# EAGLE design 230V (EAGLE 5.11)
ABBREV: jn6; PROJECT: JeeNode v6
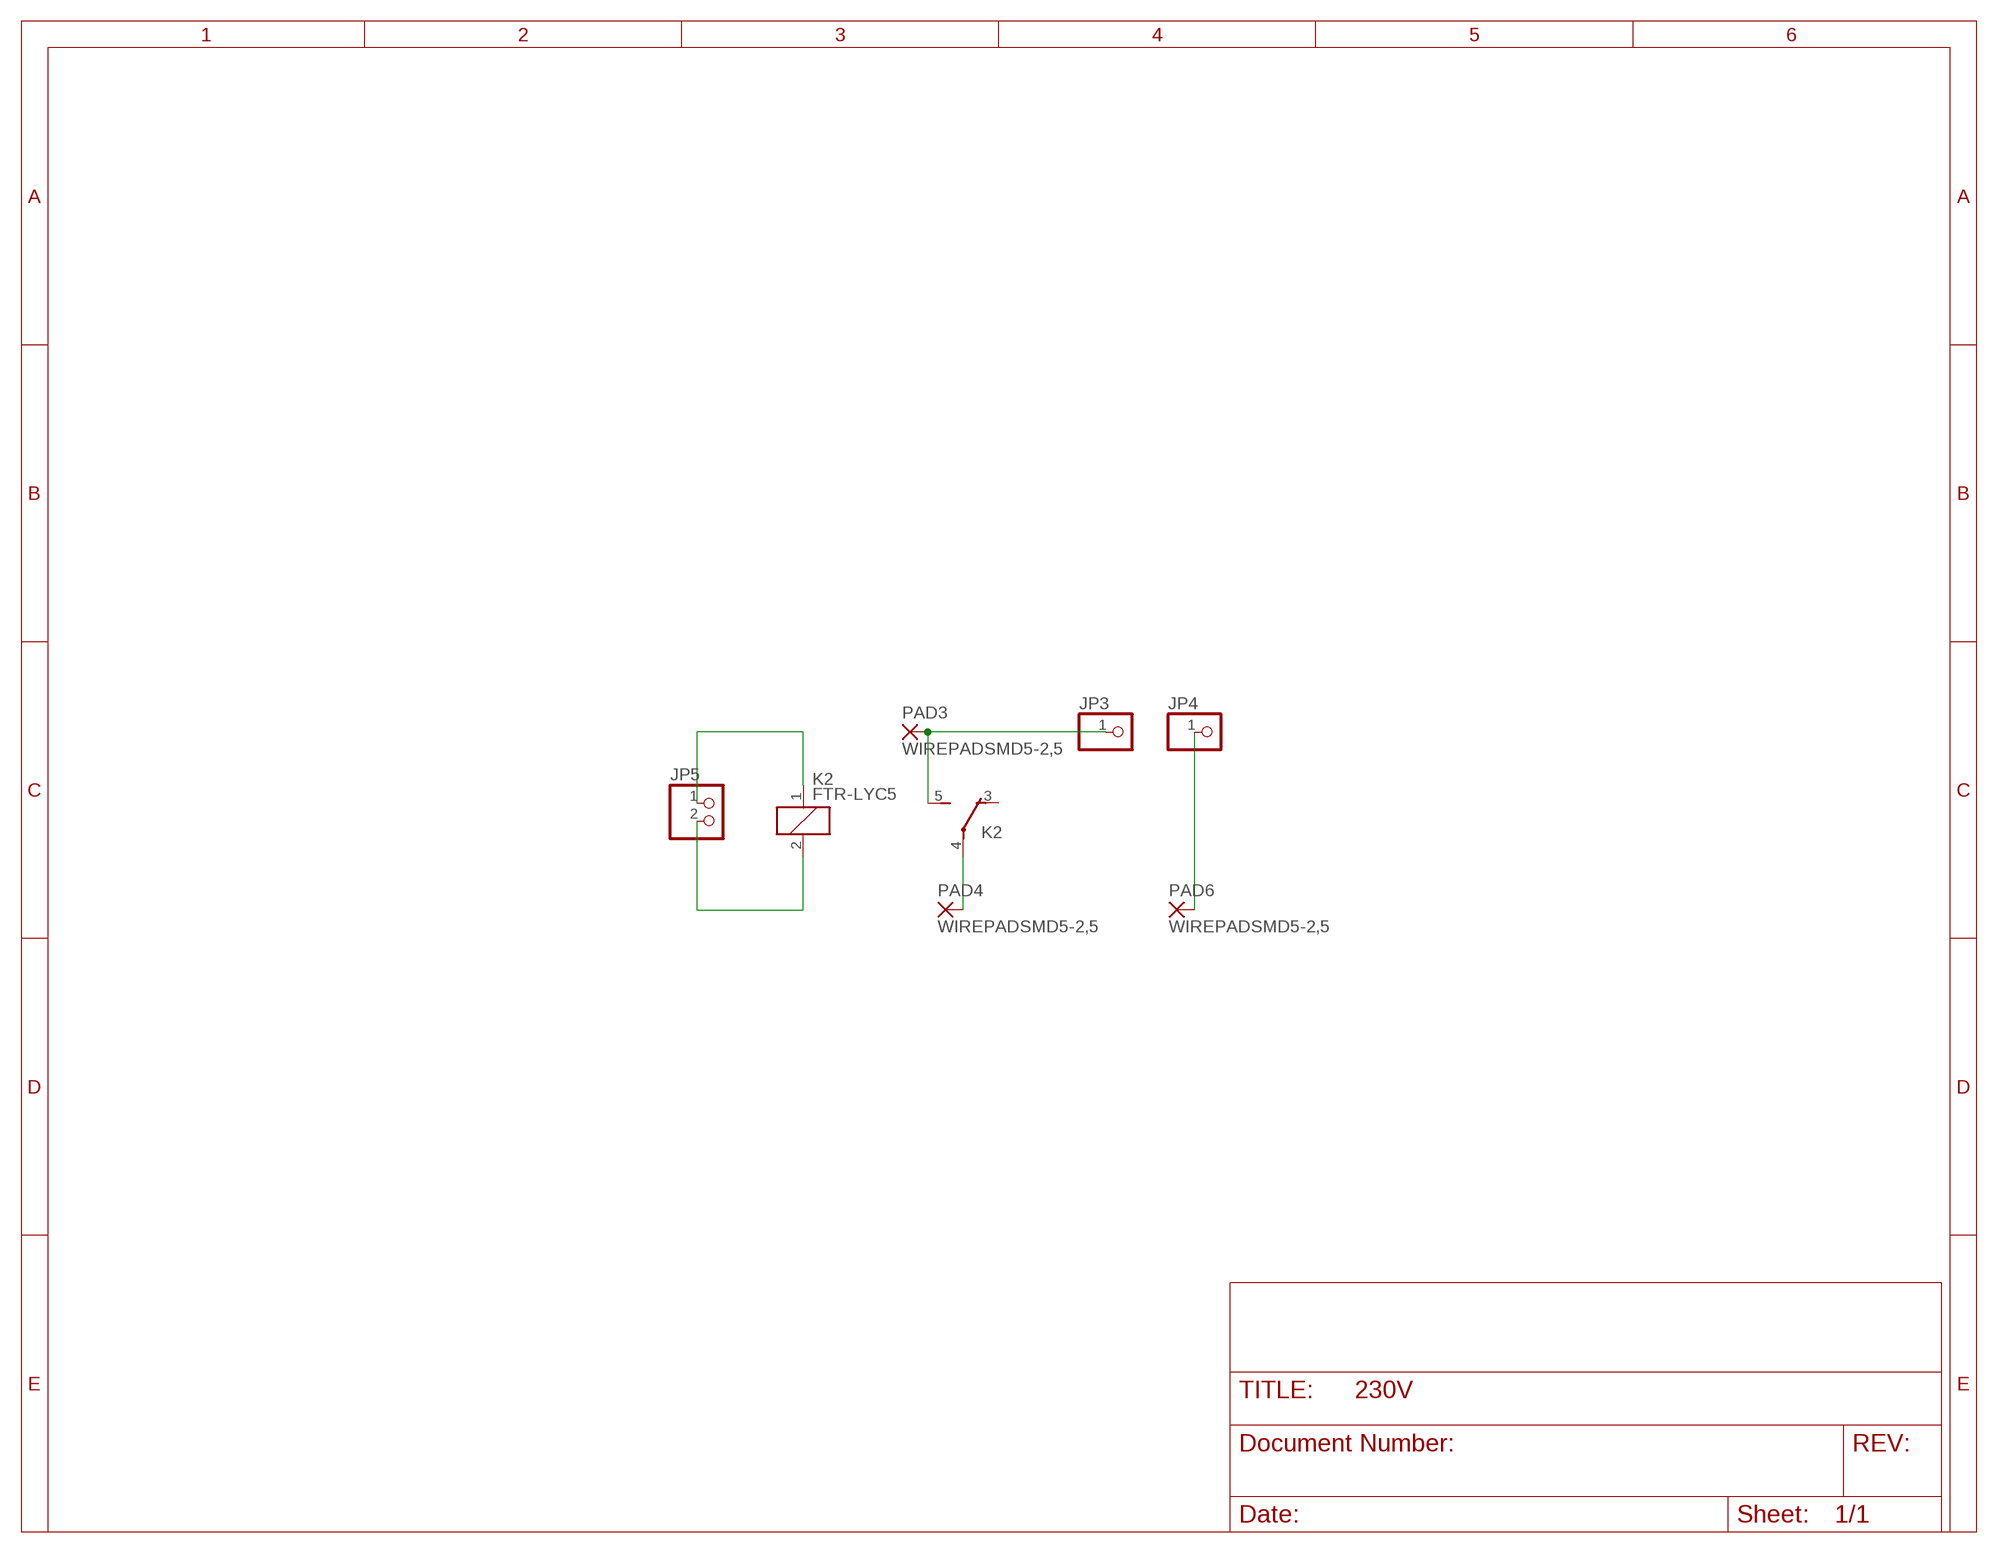
[diagram p0: schematic, sheet 1]

## Parts
JP3  PINHD-1X1  [1X01]
JP4  PINHD-1X1  [1X01]
JP5  PINHD-1X2  [1X02]
K2  FTR-LYC5  [FTR-LYC]
PAD3  WIREPADSMD5-2,5  [5-2,5]
PAD4  WIREPADSMD5-2,5  [5-2,5]
PAD6  WIREPADSMD5-2,5  [5-2,5]

## Nets
N$1: K2.4(-1:P) PAD4.1(P)
N$9: JP3.1 K2.5(-1:S) PAD3.1(P)
N$14: JP5.2 K2.2
N$15: JP5.1 K2.1
N$16: JP4.1 PAD6.1(P)
Unconnected: K2.3(-1:O)

## Library data of the parts
JP3 JP4 = pinhead:PINHD-1X1: PIN HEADER
JP5 = pinhead:PINHD-1X2: PIN HEADER
K2 = relay:FTR-LYC: Schmales Netzrelais NETZRELAIS FTR-LYCA024V 1XUM 6A/250VAC Distributor: Conrad electronic Bestell Nr.: 504382 - 62 Source: http://www2.produktinfo.conrad.com/datenblaetter/500000-524999/504382-da-01-de-NETZRELAIS_FTR-LYCA024V_1XUM_6A_250VAC.pdf; OC_FARNELL: unknown; OC_NEWARK: unknown
PAD3 PAD4 PAD6 = wirepad:WIREPAD: Wire PAD connect wire on PCB

## Net classes
1 power: width 0.381 mm, clearance 0.254 mm

## Board
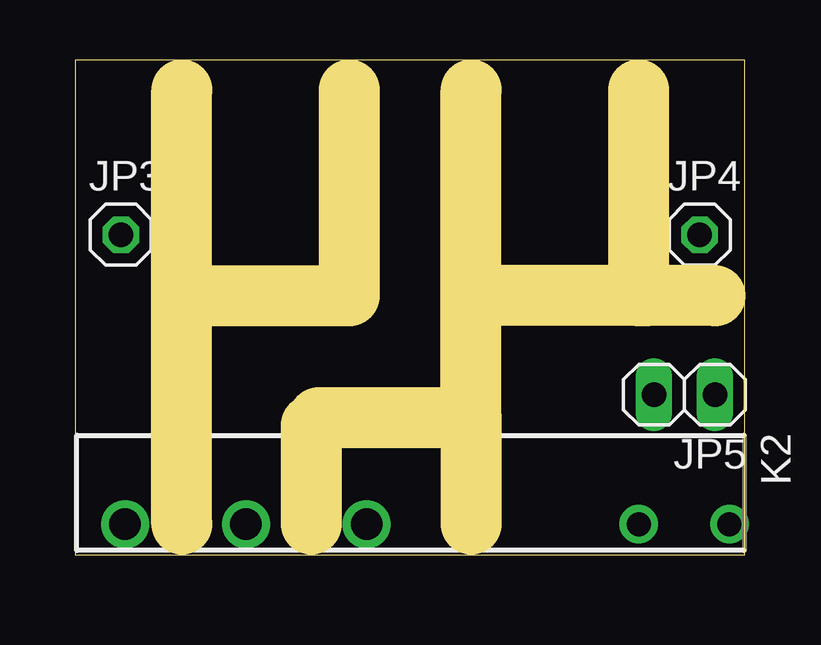
[diagram p1: board, top side]
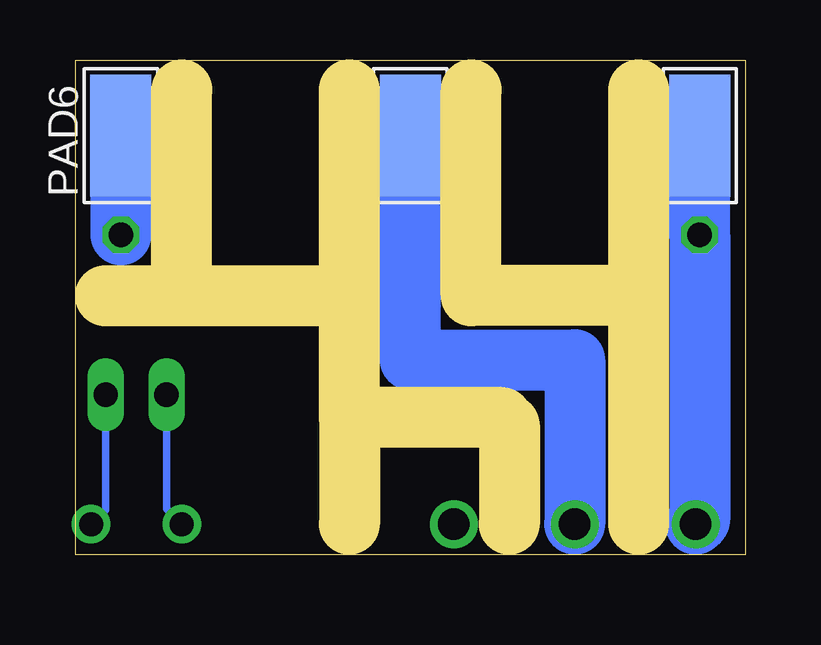
[diagram p2: board, bottom side, seen from below]

Size 27.92 x 20.62 mm. Coordinates in mm from the lower left corner, seen from the top.
Outline: 0,0 27.92,0 27.92,20.62 0,20.62 0,0
Copper layers (1*16): Top 0.035mm / dielectric 1.5mm / Bottom 0.035mm
Design rules "default": minimum track width 10mil, minimum drill 24mil, track to track 8mil, track to pad 8mil, pad to pad 8mil, via to via 8mil, smd to smd 8mil, copper to edge 40mil, drill to drill 8mil, minimum pad ring 10mil, minimum via ring 8mil, stop-mask expansion 4mil, vias tented up to drill 0mil, thermal gap 10mil
Milling: 12 lines

### Footprints (pad centres in the part's own frame; a part is rotated, then mirrored left to right if it is on the bottom)
1X01 = drill 1.016 octagon: 1 0,0
1X02 = drill 1.016 long: 1 -1.27,0; 2 1.27,0
FTR-LYC = drill 1 pad 1.6 round: 1 -3.78,0; 2 0,0 | drill 1.3 pad 2 round: 3 11.34,0; 4 16.38,0; 5 21.42,0
5-2,5 = smd 2.54 x 5.08: 1 0,0

### Placement (x,y rotation side)
JP3  1.91,13.34 0 top
JP4  26.04,13.34 0 top
JP5  25.4,6.67 180 top
K2  23.5,1.27 180 top
PAD3  1.91,17.46 0 bottom
PAD4  13.97,17.46 0 bottom
PAD6  26.04,17.46 0 bottom

### Tracks (layer width: path | path; a pad name or v marks a point on that pad's centre or on a via)
N$1
  Bottom 2.54: PAD4.1 13.97,8.12 7.12,8.12 K2.4
N$9
  Bottom 2.54: PAD3.1 JP3.1 1.91,1.44 K2.5
N$14
  Bottom 0.305: JP5.2 24.13,1.91 K2.2
N$15
  Bottom 0.305: JP5.1 26.67,1.88 K2.1
N$16
  Bottom 2.54: PAD6.1 JP4.1